# EAGLE design yuniminMainboard (EAGLE 4.11)
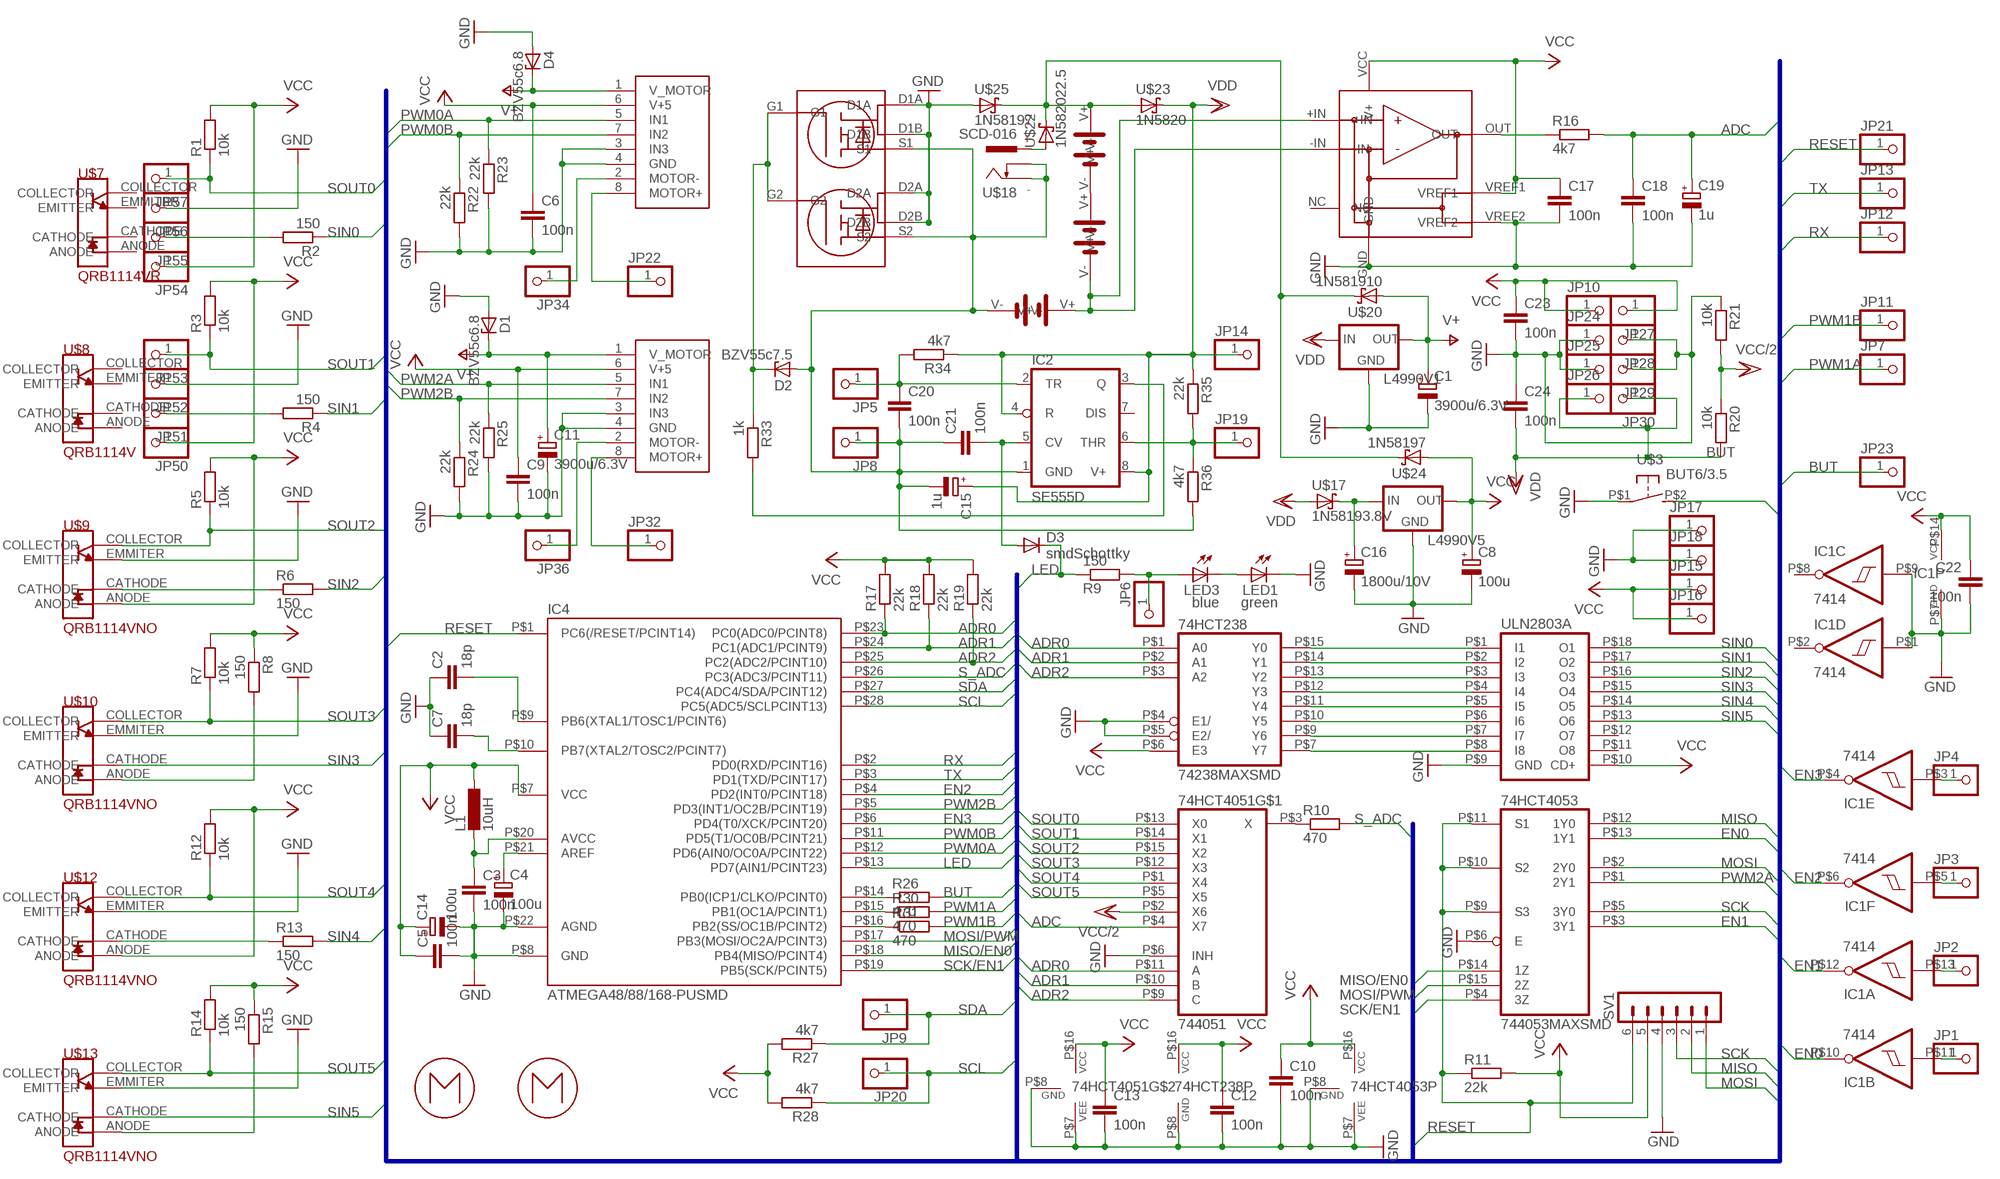
[diagram p0: schematic, sheet 1]

## Parts
74HCT238  74238MAXSMD  [DIL16SMD]
74HCT4051  744051  [DIL16SMD]
74HCT4053  744053MAXSMD  [DIL16SMD]
C1  3900u/6.3V  CPOL-EUE5-10.5  [E5-10,5]
C2  18p  C-EUC1206  [C1206]
C3  100n  C-EUC1206  [C1206]
C4  100u  CPOL-EUC/6032-28R  [C/6032-28R]
C5  100n  C-EUC1206  [C1206]
C6  100n  C-EUC1206  [C1206]
C7  18p  C-EUC1206  [C1206]
C8  100u  CPOL-EUC/6032-28R  [C/6032-28R]
C9  100n  C-EUC1206  [C1206]
C10  100n  C-EUC1206  [C1206]
C11  3900u/6.3V  CPOL-EUE5-10.5  [E5-10,5]
C12  100n  C-EUC1206  [C1206]
C13  100n  C-EUC1206  [C1206]
C14  100u  CPOL-EUC/6032-28R  [C/6032-28R]
C15  1u  CPOL-EUB/3528-21R  [B/3528-21R]
C16  1800u/10V  CPOL-EUE5-10.5  [E5-10,5]
C17  100n  C-EUC1206  [C1206]
C18  100n  C-EUC1206  [C1206]
C19  1u  CPOL-EUB/3528-21R  [B/3528-21R]
C20  100n  C-EUC1206  [C1206]
C21  100n  C-EUC1206  [C1206]
C22  100n  C-EUC1206  [C1206]
C23  100n  C-EUC1206  [C1206]
C24  100n  C-EUC1206  [C1206]
D1  BZV55c6.8  ZENER-DIODESOD80C  [SOD80C]
D2  BZV55c7.5  ZENER-DIODESOD80C  [SOD80C]
D3  smdSchottky  DIODE-DO214BA  [DO-214BA]
D4  BZV55c6.8  ZENER-DIODESOD80C  [SOD80C]
IC1  7414  7414MAXISMD  [DIL14SMD]
IC2  SE555D  [SO08]
IC4  ATMEGA48/88/168-PUSMD  [DIL28-SMD]
JP1  PINHD-1X1  [1X01]
JP2  PINHD-1X1  [1X01]
JP3  PINHD-1X1  [1X01]
JP4  PINHD-1X1  [1X01]
JP5  PINHD-1X1  [1X01]
JP6  PINHD-1X1  [1X01]
JP7  PINHD-1X1  [1X01]
JP8  PINHD-1X1  [1X01]
JP9  PINHD-1X1  [1X01]
JP10  PINHD-1X1  [1X01]
JP11  PINHD-1X1  [1X01]
JP12  PINHD-1X1  [1X01]
JP13  PINHD-1X1  [1X01]
JP14  PINHD-1X1  [1X01]
JP15  PINHD-1X1  [1X01]
JP16  PINHD-1X1  [1X01]
JP17  PINHD-1X1  [1X01]
JP18  PINHD-1X1  [1X01]
JP19  PINHD-1X1  [1X01]
JP20  PINHD-1X1  [1X01]
JP21  PINHD-1X1  [1X01]
JP22  PINHD-1X1  [1X01]
JP23  PINHD-1X1  [1X01]
JP24  PINHD-1X1  [1X01]
JP25  PINHD-1X1  [1X01]
JP26  PINHD-1X1  [1X01]
JP27  PINHD-1X1  [1X01]
JP28  PINHD-1X1  [1X01]
JP29  PINHD-1X1  [1X01]
JP30  PINHD-1X1  [1X01]
JP32  PINHD-1X1  [1X01]
JP34  PINHD-1X1  [1X01]
JP36  PINHD-1X1  [1X01]
JP50  PINHD-1X1  [1X01]
JP51  PINHD-1X1  [1X01]
JP52  PINHD-1X1  [1X01]
JP53  PINHD-1X1  [1X01]
JP54  PINHD-1X1  [1X01]
JP55  PINHD-1X1  [1X01]
JP56  PINHD-1X1  [1X01]
JP57  PINHD-1X1  [1X01]
L1  10uH  L-EU0207/10  [0207/10]
L4990V1  78XXS  [78XXS]
L4990V5  78XXS  [78XXS]
LED1  green  LEDSMT1206  [1206]
LED3  blue  LED3MM  [LED3MM]
R1  10k  R-EU_R1206  [R1206]
R2  150  R-EU_R1206  [R1206]
R3  10k  R-EU_R1206  [R1206]
R4  150  R-EU_R1206  [R1206]
R5  10k  R-EU_R1206  [R1206]
R6  150  R-EU_R1206  [R1206]
R7  10k  R-EU_R1206  [R1206]
R8  150  R-EU_R1206  [R1206]
R9  150  R-EU_R1206  [R1206]
R10  470  R-EU_R1206  [R1206]
R11  22k  R-EU_R1206  [R1206]
R12  10k  R-EU_R1206  [R1206]
R13  150  R-EU_R1206  [R1206]
R14  10k  R-EU_R1206  [R1206]
R15  150  R-EU_R1206  [R1206]
R16  4k7  R-EU_R1206  [R1206]
R17  22k  R-EU_R1206  [R1206]
R18  22k  R-EU_R1206  [R1206]
R19  22k  R-EU_R1206  [R1206]
R20  10k  R-EU_R1206  [R1206]
R21  10k  R-EU_R1206  [R1206]
R22  22k  R-EU_R1206  [R1206]
R23  22k  R-EU_R1206  [R1206]
R24  22k  R-EU_R1206  [R1206]
R25  22k  R-EU_R1206  [R1206]
R26  470  R-EU_R1206  [R1206]
R27  4k7  R-EU_R1206  [R1206]
R28  4k7  R-EU_R1206  [R1206]
R30  470  R-EU_R1206  [R1206]
R31  470  R-EU_R1206  [R1206]
R33  1k  R-EU_R1206  [R1206]
R34  4k7  R-EU_R1206  [R1206]
R35  22k  R-EU_R1206  [R1206]
R36  4k7  R-EU_R1206  [R1206]
SV1  MA06-1  [MA06-1]
U$1  MOTORGW8TOP  [GW8L_TOP]
U$2  MOTORGW8TOP  [GW8L_TOP]
U$3  BUT6/3.5  [BUT6/3.5SMD]
U$4  ACU2  [ACU2AAA]
U$5  ACU2  [ACU2AAA]
U$6  ACU2  [ACU2AAA]
U$7  QRB1114VR  [QRB1114VR]
U$8  QRB1114V  QRB1114VL  [QRB1114VL]
U$9  QRB1114VNO  [QRB1114V]
U$10  QRB1114VNO  [QRB1114V]
U$12  QRB1114VNO  [QRB1114V]
U$13  QRB1114VNO  [QRB1114V]
U$14  AD8205  [SOIC8]
U$15  HT6751B  [SO8]
U$16  HT6751B  [SO8]
U$17  1N58193.8V  [DO41-3.8]
U$18  SCD-016  [SCD-016]
U$19  CEM9926  [SO8]
U$20  1N581910  [DO41-10]
U$22  1N582022.5  [DO201-22.5]
U$23  1N5820  [DO201VERTIKAL]
U$24  1N58197  [DO41-7]
U$25  1N58197  [DO41-7]
ULN2803A  ULN2803AMAXISMD  [DIL18SMD]

## Nets
ADC: 74HCT4051.P$4(X7) C18.1 C19.+ R16.2
ADR0: 74HCT238.P$1(A0) 74HCT4051.P$11(A) IC4.P$23(PC0(ADC0/PCINT8)) R17.1
ADR1: 74HCT238.P$2(A1) 74HCT4051.P$10(B) IC4.P$24(PC1(ADC1/PCINT9)) R18.1
ADR2: 74HCT238.P$3(A2) 74HCT4051.P$9(C) IC4.P$25(PC2(ADC2/PCINT10)) R19.1
BUT: JP23.1 R26.2 U$3.P$2(S)
EN0: 74HCT4053.P$13(1Y1) IC1.P$10(B:O)
EN1: 74HCT4053.P$3(3Y1) IC1.P$12(A:O)
EN2: IC1.P$6(F:O) IC4.P$4(PD2(INT0/PCINT18))
EN3: IC1.P$4(E:O) IC4.P$6(PD4(T0/XCK/PCINT20))
GND: 74HCT238.P$4(E1/) 74HCT238.P$5(E2/) 74HCT238.P$8(GND) 74HCT4051.P$6(INH) 74HCT4051.P$7(VEE) 74HCT4051.P$8(GND) 74HCT4053.P$6(E) 74HCT4053.P$7(VEE) 74HCT4053.P$8(GND) C1.- C2.1 C3.2 C4.- C5.2 C6.2 C7.1 C8.- C9.2 C10.2 C11.- C12.2 C13.2 C14.- C16.- C17.2 C18.2 C19.- C22.2 C23.2 C24.1 D1.A D4.A IC1.P$1(D:I) IC1.P$7(P:GND) IC1.P$9(C:I) IC4.P$8(GND) IC4.P$22(AGND) JP17.1 JP18.1 JP24.1 JP25.1 JP28.1 JP29.1 JP52.1 JP56.1 L4990V1.GND L4990V5.GND LED1.C R21.1 R22.2 R23.2 R24.2 R25.2 SV1.4 U$3.P$1(P) U$9.EMMITER(EMITTER) U$10.EMMITER(EMITTER) U$12.EMMITER(EMITTER) U$13.EMMITER(EMITTER) U$14.GND U$14.VREF2 U$15.3(IN3) U$15.4(GND) U$16.3(IN3) U$16.4(GND) U$19.D1A U$19.D1B U$19.D2A U$19.D2B U$25.A ULN2803A.P$9(GND)
LED: D3.C IC4.P$13(PD7(AIN1/PCINT23)) R9.1
MISO: 74HCT4053.P$12(1Y0) SV1.2
MISO/EN0: 74HCT4053.P$14(1Z) IC4.P$18(PB4(MISO/PCINT4))
MOSI: 74HCT4053.P$2(2Y0) SV1.1
MOSI/PWM: 74HCT4053.P$15(2Z) IC4.P$17(PB3(MOSI/OC2A/PCINT3))
N$1: JP55.1 R2.2
N$2: D2.C R33.1 U$19.G1 U$19.G2
N$3: 74HCT4051.P$3(X) R10.1
N$4: R6.1 U$9.CATHODE
N$5: U$4.V+ U$20.C U$22.C U$23.A U$24.C U$25.C
N$6: R15.2 U$13.ANODE
N$7: JP51.1 R4.2
N$8: C21.2 D3.A IC2.5(CV)
N$9: R8.2 U$10.ANODE
N$10: IC1.P$5(F:I) JP3.1
N$11: U$5.V- U$6.V+ U$14.+IN U$14.-IN
N$12: U$4.V- U$5.V+
N$13: 74HCT238.P$15(Y0) ULN2803A.P$1(I1)
N$14: 74HCT238.P$14(Y1) ULN2803A.P$2(I2)
N$15: 74HCT238.P$13(Y2) ULN2803A.P$3(I3)
N$16: 74HCT238.P$12(Y3) ULN2803A.P$4(I4)
N$17: 74HCT238.P$11(Y4) ULN2803A.P$5(I5)
N$18: 74HCT238.P$10(Y5) ULN2803A.P$6(I6)
N$19: 74HCT238.P$9(Y6) ULN2803A.P$7(I7)
N$20: 74HCT238.P$7(Y7) ULN2803A.P$8(I8)
N$21: JP6.1 LED3.A R9.2
N$22: IC4.P$14(PB0(ICP1/CLKO/PCINT0)) R26.1
N$23: C3.1 IC4.P$20(AVCC) L1.2
N$24: C4.+ IC4.P$21(AREF)
N$25: JP32.1 U$15.8(MOTOR+)
N$26: JP36.1 U$15.2(MOTOR-)
N$27: JP22.1 U$16.8(MOTOR+)
N$28: JP34.1 U$16.2(MOTOR-)
N$29: LED1.A LED3.K(C)
N$30: R13.1 U$12.CATHODE
N$32: IC4.P$15(PB1(OC1A/PCINT1)) R30.1
N$33: IC4.P$16(PB2(SS/OC1B/PCINT2)) R31.1
N$34: C7.2 IC4.P$10(PB7(XTAL2/TOSC2/PCINT7))
N$35: C2.2 IC4.P$9(PB6(XTAL1/TOSC1/PCINT6))
N$36: IC1.P$13(A:I) JP2.1
N$37: C16.+ L4990V5.IN U$17.C
N$38: U$18.+ U$22.A
N$39: IC1.P$3(E:I) JP4.1
N$40: IC1.P$11(B:I) JP1.1
N$42: R16.1 U$14.OUT
N$44: IC2.3(Q) R33.2
PWM0A: IC4.P$12(PD6(AIN0/OC0A/PCINT22)) R23.1 U$16.5(IN1)
PWM0B: IC4.P$11(PD5(T1/OC0B/PCINT21)) R22.1 U$16.7(IN2)
PWM1A: JP7.1 R30.2
PWM1B: JP11.1 R31.2
PWM2A: 74HCT4053.P$1(2Y1) R25.1 U$15.5(IN1)
PWM2B: IC4.P$5(PD3(INT1/OC2B/PCINT19)) R24.1 U$15.7(IN2)
RESET: 74HCT4053.P$9(S3) 74HCT4053.P$10(S2) 74HCT4053.P$11(S1) IC4.P$1(PC6(/RESET/PCINT14)) JP21.1 R11.1 SV1.6
RX: IC4.P$2(PD0(RXD/PCINT16)) JP12.1
S_ADC: IC4.P$26(PC3(ADC3/PCINT11)) R10.2
SCK: 74HCT4053.P$5(3Y0) SV1.3
SCK/EN1: 74HCT4053.P$4(3Z) IC4.P$19(PB5(SCK/PCINT5))
SCL: IC4.P$28(PC5(ADC5/SCLPCINT13)) JP20.1 R28.1
SDA: IC4.P$27(PC4(ADC4/SDA/PCINT12)) JP9.1 R27.1
SIN0: R2.1 ULN2803A.P$18(O1)
SIN1: R4.1 ULN2803A.P$17(O2)
SIN2: R6.2 ULN2803A.P$16(O3)
SIN3: U$10.CATHODE ULN2803A.P$15(O4)
SIN4: R13.2 ULN2803A.P$14(O5)
SIN5: U$13.CATHODE ULN2803A.P$13(O6)
SOUT0: 74HCT4051.P$13(X0) JP57.1 R1.1
SOUT1: 74HCT4051.P$14(X1) JP53.1 R3.1
SOUT2: 74HCT4051.P$15(X2) R5.1 U$9.COLLECTOR
SOUT3: 74HCT4051.P$12(X3) R7.1 U$10.COLLECTOR
SOUT4: 74HCT4051.P$1(X4) R12.1 U$12.COLLECTOR
SOUT5: 74HCT4051.P$5(X5) R14.1 U$13.COLLECTOR
THR: IC2.6(THR) JP19.1 R35.2 R36.1
TR: C20.1 IC2.2(TR) JP5.1 R34.2
TX: IC4.P$3(PD1(TXD/PCINT17)) JP13.1
V+: C1.+ C11.+ D1.C D4.C L4990V1.OUT U$15.1(V_MOTOR) U$16.1(V_MOTOR) U$20.A
V-BAT: C15.- C20.2 C21.1 D2.A IC2.1(GND) JP8.1 R36.2 U$6.V- U$18.- U$18.C U$19.S1 U$19.S2
VCC: 74HCT238.P$6(E3) 74HCT238.P$16(VCC) 74HCT4051.P$16(VCC) 74HCT4053.P$16(VCC) C5.1 C6.1 C8.+ C9.1 C10.1 C12.1 C13.1 C14.+ C17.1 C22.1 C23.1 IC1.P$14(P:VCC) IC4.P$7(VCC) JP10.1 JP15.1 JP16.1 JP27.1 JP50.1 JP54.1 L1.1 L4990V5.OUT R1.2 R3.2 R5.2 R7.2 R8.1 R11.2 R12.2 R14.2 R15.1 R17.2 R18.2 R19.2 R27.2 R28.2 SV1.5 U$9.ANODE U$12.ANODE U$14.VCC(V+) U$14.VREF1 U$15.6(V+5) U$16.6(V+5) U$24.A ULN2803A.P$10(CD+)
VCC/2: 74HCT4051.P$2(X6) R20.1 R21.2
VDD: C15.+ C24.2 IC2.4(R) IC2.8(V+) JP14.1 JP26.1 JP30.1 L4990V1.IN R20.2 R34.1 R35.1 U$17.A U$23.C
Unconnected: IC1.P$2(D:O) IC1.P$8(C:O) IC2.7(DIS) U$7.ANODE U$7.CATHODE U$7.COLLECTOR U$7.EMMITER(EMITTER) U$8.ANODE U$8.CATHODE U$8.COLLECTOR U$8.EMMITER(EMITTER) U$14.NC ULN2803A.P$11(O8) ULN2803A.P$12(O7)

## Buses
ADC,S_ADC,ADR[0..2],LED,EN[0..3],PWM0A,BUT,PWM1A,PWM1B,PWM0B,SCK,SCK/EN1,MISO,MISO/EN0,MOSI,MOSI/PWM,PWM2A,PWM2B,RESET,SDA,SCL,SIN[0..7],SOUT[0..7],RX,TX

## Library data of the parts
74HCT238 = 74:74*238: 3-line to 8-line DECODER/DEMULTIPLEXER
74HCT4051 = 74:74*4051
74HCT4053 = 74:74*4053: Triple 2-channel analog multiplexer/demultiplexer Philips Semiconductor
C1 C4 C8 C11 C14-C16 C19 = rcl:CPOL-EU: POLARIZED CAPACITOR, European symbol
C2 C3 C5-C7 C9 C10 C12 C13 C17 C18 C20-C24 = rcl:C-EU: CAPACITOR, European symbol
D1 D2 D4 = diode:ZENER-DIODE: Z-Diode
D3 = diode:DIODE-: DIODE
IC1 = 74:74*14: Hex schmitt trigger INVERTER
IC2 = linear:*555: TIMER
IC4 = atmega8:ATMEGA48/88/168-PU
JP1-JP30 JP32 JP34 JP36 JP50-JP57 = pinhead:PINHD-1X1: PIN HEADER
L1 = rcl:L-EU: INDUCTOR, European symbol
L4990V1 L4990V5 = v-reg:78XXS: VOLTAGE REGULATOR
LED1 LED3 = led:LED: LED OSRAM: - CHIPLED LG R971, LG N971, LY N971, LG Q971, LY Q971, LO R971, LY R971 LH N974, LH R974 LS Q976, LO Q976, LY Q976 LO Q996 - Hyper CHIPLED LW Q18S LB Q993, LB Q99A, LB R99A - SideLED LS A670, LO A670, LY A670, LG A670, LP A670 LB A673, LV A673, LT A673, LW A673 LH A674 LY A675 LS A676, LA A676, LO A676, LY A676, LW A676 LS A679, LY A679, LG A679 - Hyper Micro SIDELED® LS Y876, LA Y876, LO Y876, LY Y876 LT Y87S - SmartLED LW L88C, LW L88S LB L89C, LB L89S, LG L890 LS L89K, LO L89K, LY L89K LS L896, LA L896, LO L896, LY L896 - TOPLED LS T670, LO T670, LY T670, LG T670, LP T670 LSG T670, LSP T670, LSY T670, LOP T670, LYG T670 LG T671, LOG T671, LSG T671 LB T673, LV T673, LT T673, LW T673 LH T674 LS T676, LA T676, LO T676, LY T676, LB T676, LH T676, LSB T676, LW T676 LB T67C, LV T67C, LT T67C, LS T67K, LO T67K, LY T67K, LW E67C LS E67B, LA E67B, LO E67B, LY E67B, LB E67C, LV E67C, LT E67C LW T67C LS T679, LY T679, LG T679 LS T770, LO T770, LY T770, LG T770, LP T770 LB T773, LV T773, LT T773, LW T773 LH T774 LS E675, LA E675, LY E675, LS T675 LS T776, LA T776, LO T776, LY T776, LB T776 LHGB T686 LT T68C, LB T68C - Hyper Mini TOPLED® LB M676 - Mini TOPLED Santana® LG M470 LS M47K, LO M47K, LY M47K Source: http://www.osram.convergy.de/
R1-R28 R30 R31 R33-R36 = rcl:R-EU_: RESISTOR, European symbol
SV1 = con-lstb:MA06-1: PIN HEADER
U$1 U$2 = motors:MOTORGW8
U$3 = but:BUT6/3.5
U$4-U$6 = acu:ACU2
U$7-U$10 U$12 U$13 = sensor:QRB1114V
U$14 = oa:AD8205
U$15 U$16 = drivers:HT6751B
U$17 U$20 U$24 U$25 = diode:1N5819
U$18 = conectors:SCD-016
U$19 = unipolartransistor:CEM9926
U$22 U$23 = diode:1N5820
ULN2803A = uln:ULN2803A: DRIVER ARRAY

## Board
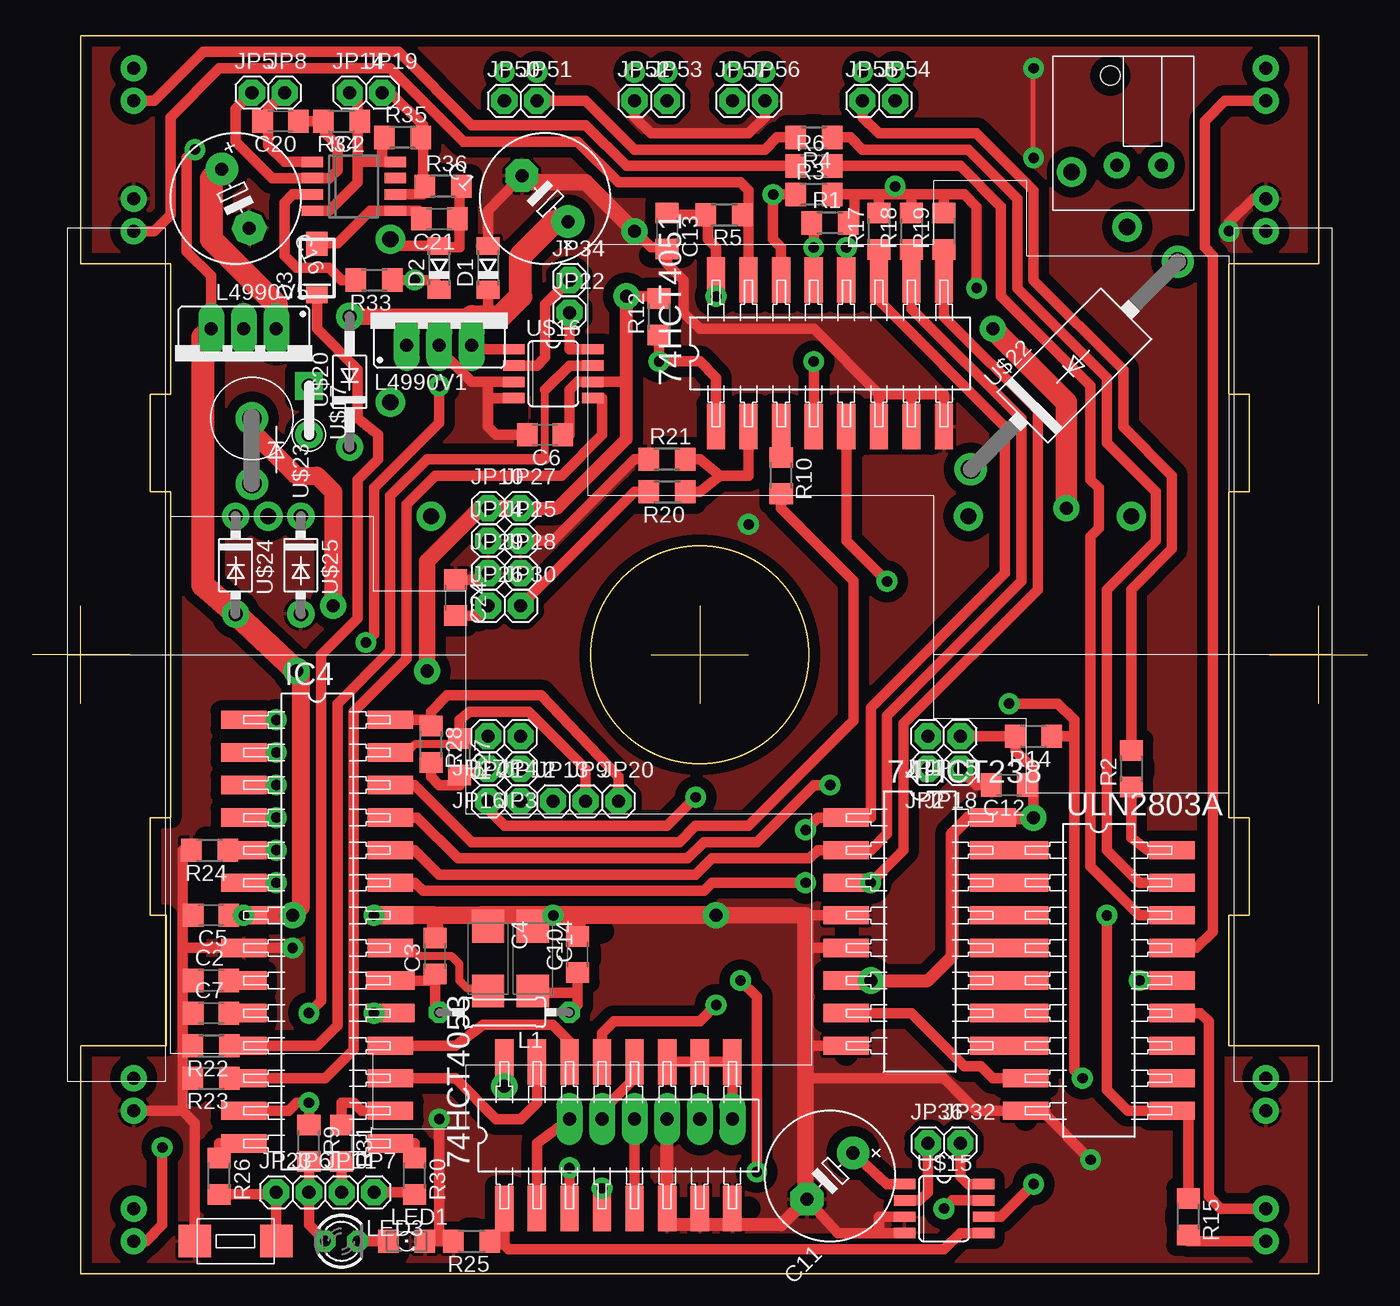
[diagram p1: board, top side]
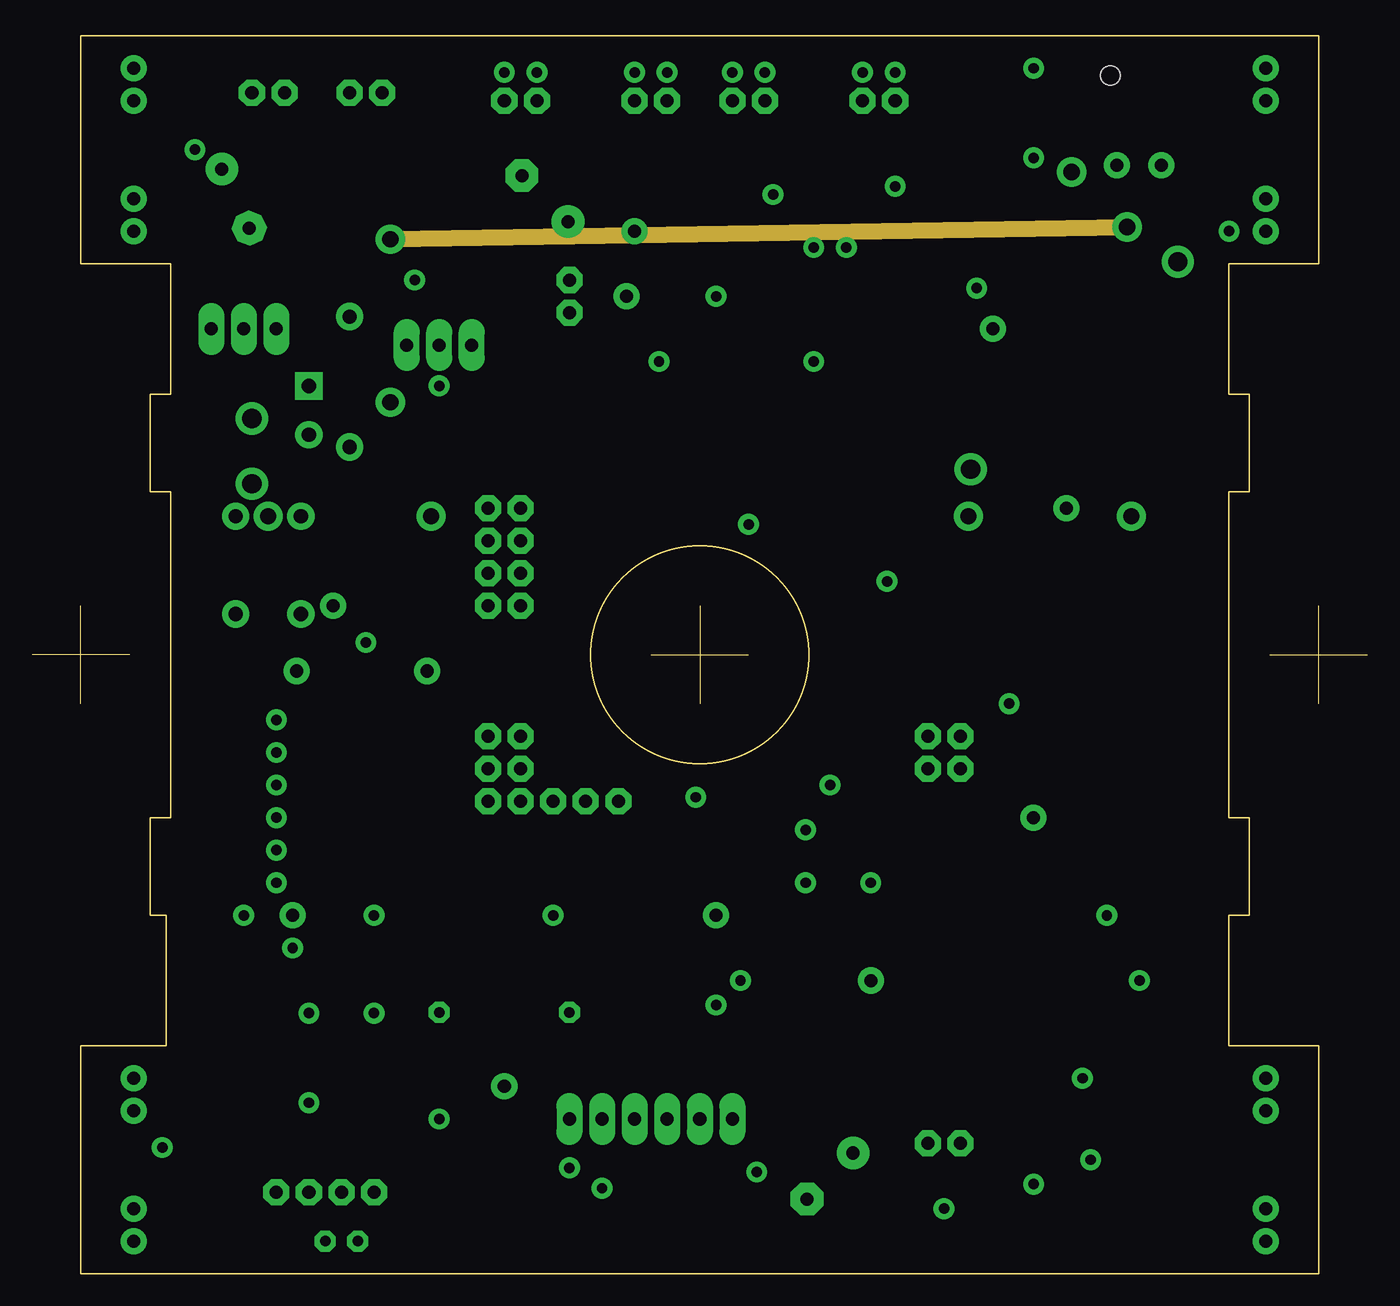
[diagram p2: board, inner layer Route9]
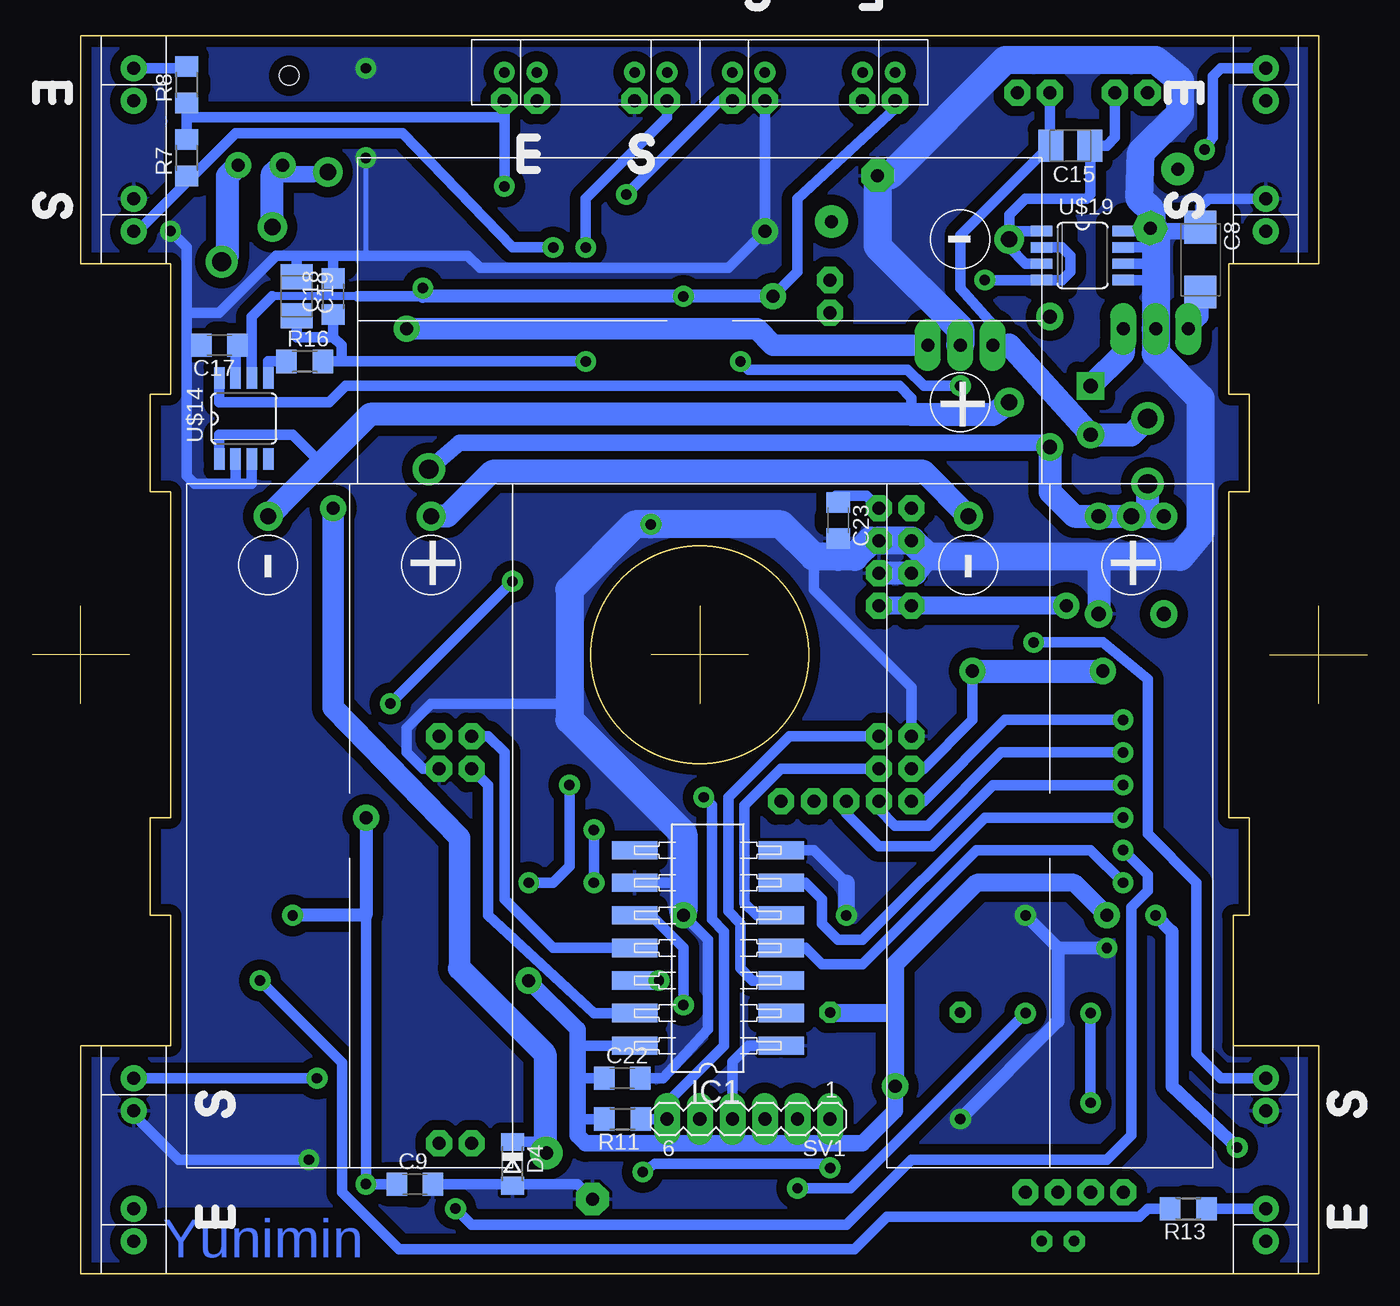
[diagram p3: board, bottom side, seen from below]

Size 104.14 x 96.52 mm. Coordinates in mm from the lower left corner, seen from the top.
Outline: 48.26,48.26 55.88,48.26
Outline: 52.07,52.07 52.07,44.45
Outline: 96.52,48.26 104.14,48.26
Outline: 100.33,44.45 100.33,52.07
Outline: 7.62,48.26 0,48.26
Outline: 3.81,44.45 3.81,52.07
Outline: 3.81,0 100.33,0 100.33,17.78 93.34,17.78 93.34,27.94 94.93,27.94 94.93,35.56 93.34,35.56 93.34,60.96 94.93,60.96 94.93,68.58 93.34,68.58 93.34,78.74 100.33,78.74 100.33,96.52 3.81,96.52 3.81,78.74 10.8,78.74 10.8,68.58 9.21,68.58 9.21,60.96 10.8,60.96 10.8,35.56 9.21,35.56 9.21,27.94 10.48,27.94 10.48,17.78 3.81,17.78 3.81,0
Outline: circle at 52.07,48.26 radius 8.5
Copper layers (1*16): Top 0.035mm / dielectric 1.5mm / Bottom 0.035mm
Design rules "default": minimum track width 10mil, minimum drill 24mil, track to track 8mil, track to pad 8mil, pad to pad 8mil, via to via 8mil, smd to smd 8mil, copper to edge 1mil, drill to drill 1mil, minimum pad ring 10mil, minimum via ring 8mil, stop-mask expansion 4mil, vias tented up to drill 0mil, thermal gap 10mil
tRestrict: 18 lines
bRestrict: 10 lines

### Footprints (pad centres in the part's own frame; a part is rotated, then mirrored left to right if it is on the bottom)
DIL16SMD = smd 1.422 x 3.556: P$1 -8.89,-6.35; P$2 -6.35,-6.35; P$3 -3.81,-6.35; P$4 -1.27,-6.35; P$5 1.27,-6.35; P$6 3.81,-6.35; P$7 6.35,-6.35; P$8 8.89,-6.35; P$9 8.89,5.08; P$10 6.35,5.08; P$11 3.81,5.08; P$12 1.27,5.08; P$13 -1.27,5.08; P$14 -3.81,5.08; P$15 -6.35,5.08; P$16 -8.89,5.08
E5-10,5 = drill 1.016 pad 2.54 round: + -2.54,0 | drill 1.016 pad 2.54 octagon: - 2.54,0
C1206 = smd 1.6 x 1.8: 1 -1.4,0; 2 1.4,0
C/6032-28R = smd 2.55 x 2.5: + 2.525,0; - -2.525,0
B/3528-21R = smd 1.95 x 2.5: + 1.525,0; - -1.525,0
SOD80C = smd 1.4 x 1.8: A 1.7,0; C -1.7,0
DO-214BA = smd 1.85 x 1.68: A 1.87,0 | smd 1.32 x 1.68: C -2.12,0
DIL14SMD = smd 1.422 x 3.556: P$1 -8.89,-6.35; P$2 -6.35,-6.35; P$3 -3.81,-6.35; P$4 -1.27,-6.35; P$5 1.27,-6.35; P$6 3.81,-6.35; P$7 6.35,-6.35; P$8 6.35,5.08; P$9 3.81,5.08; P$10 1.27,5.08; P$11 -1.27,5.08; P$12 -3.81,5.08; P$13 -6.35,5.08; P$14 -8.89,5.08
SO08 = smd 0.813 x 1.676: 1 -1.905,-3.235; 2 -0.635,-3.235; 3 0.635,-3.235; 4 1.905,-3.235; 5 1.905,3.235; 6 0.635,3.235; 7 -0.635,3.235; 8 -1.905,3.235
DIL28-SMD = smd 1.422 x 3.556: P$1 -16.51,-6.35; P$2 -13.97,-6.35; P$3 -11.43,-6.35; P$4 -8.89,-6.35; P$5 -6.35,-6.35; P$6 -3.81,-6.35; P$7 -1.27,-6.35; P$8 1.27,-6.35; P$9 3.81,-6.35; P$10 6.35,-6.35; P$11 8.89,-6.35; P$12 11.43,-6.35; P$13 13.97,-6.35; P$14 16.51,-6.35; P$15 16.51,5.08; P$16 13.97,5.08; P$17 11.43,5.08; P$18 8.89,5.08; P$21 1.27,5.08; P$22 -1.27,5.08; P$23 -3.81,5.08; P$24 -6.35,5.08; P$25 -8.89,5.08; P$26 -11.43,5.08; P$27 -13.97,5.08; P$28 -16.51,5.08 | smd 1.422 x 3.81: P$19 6.35,5.08; P$20 3.81,5.08
1X01 = drill 1.016 octagon: 1 0,0
0207/10 = drill 0.813 octagon: 1 -5.08,0; 2 5.08,0
78XXS = drill 1.016 long: GND 0,-2.54; IN -2.54,-2.54; OUT 2.54,-2.54
1206 = smd 1.6 x 1.803: A -1.422,0; C 1.422,0
LED3MM = drill 0.813 octagon: A -1.27,0; K 1.27,0
R1206 = smd 1.6 x 1.803: 1 -1.422,0; 2 1.422,0
MA06-1 = drill 1.016 long: 1 -6.35,0; 2 -3.81,0; 3 -1.27,0; 4 1.27,0; 5 3.81,0; 6 6.35,0
BUT6/3.5SMD = smd 2.54 x 2.54: P$1 -2.54,0; P$2 3.81,0
ACU2AAA = drill 1.27 pad 1.778 round: V+ 24.13,-6.35; V- 24.13,6.35
QRB1114VR = drill 0.813 round: ANODE -2.54,6.35; CATHODE -2.54,3.81; COLLECTOR -2.54,-6.35; EMMITER -2.54,-3.81
QRB1114VL = drill 0.813 round: ANODE -2.54,6.35; CATHODE -2.54,3.81; COLLECTOR -2.54,-6.35; EMMITER -2.54,-3.81
QRB1114V = drill 1.016 round: ANODE -2.54,6.35; CATHODE -2.54,3.81; COLLECTOR -2.54,-6.35; EMMITER -2.54,-3.81
SOIC8 = smd 0.813 x 1.676: +IN -1.905,3.175; -IN -1.905,-3.175; GND -0.635,-3.175; NC 1.905,-3.175; OUT 1.905,3.175; VCC 0.635,3.175; VREF1 -0.635,3.175; VREF2 0.635,-3.175
SO8 = smd 0.813 x 1.676: 1 -1.905,-3.073; 2 -0.635,-3.073; 3 0.635,-3.073; 4 1.905,-3.073; 5 1.905,3.073; 6 0.635,3.073; 7 -0.635,3.073; 8 -1.905,3.073
DO41-3.8 = drill 1.118 round: A 1.905,0 | drill 1.118 square: C -1.905,0
SCD-016 = drill 1.016 round: + 2.475,2.975; C 2.475,-0.5 | drill 1.27 round: - 3.01,-4.01 | hole 1.5: -4.5,-1
SO8' = smd 0.813 x 1.676: D1A -1.905,3.175; D1B -0.635,3.175; D2A 0.635,3.175; D2B 1.905,3.175; G1 -0.635,-3.175; G2 1.905,-3.175; S1 -1.905,-3.175; S2 0.635,-3.175
DO41-10 = drill 1.118 round: A 5.08,0; C -5.08,0
DO201-22.5 = drill 1.499 round: A 11.43,0; C -11.43,0
DO201VERTIKAL = drill 1.499 round: A 5.08,0; C 0,0
DO41-7 = drill 1.118 round: A 3.81,0; C -3.81,0
DIL18SMD = smd 1.422 x 3.556: P$1 -10.16,-6.35; P$2 -7.62,-6.35; P$3 -5.08,-6.35; P$4 -2.54,-6.35; P$5 0,-6.35; P$6 2.54,-6.35; P$7 5.08,-6.35; P$8 7.62,-6.35; P$9 10.16,-6.35; P$10 10.16,5.08; P$11 7.62,5.08; P$12 5.08,5.08; P$13 2.54,5.08; P$14 0,5.08; P$15 -2.54,5.08; P$16 -5.08,5.08; P$17 -7.62,5.08; P$18 -10.16,5.08

### Placement (x,y rotation side)
74HCT238  69.85,26.67 270 top
74HCT4051  62.23,72.39 0 top
74HCT4053  45.72,11.43 0 top
C1  40.01,83.82 135 top
C2  13.97,22.86 0 top
C3  31.43,24.76 90 top
C4  35.56,24.57 270 top
C5  13.97,27.94 180 top
C6  40.01,65.41 180 top
C7  13.97,20.32 0 top
C8  13.02,79.06 270 bottom
C9  74.3,6.98 0 bottom
C10  42.55,24.89 90 top
C11  62.23,7.62 225 top
C12  76.2,38.1 180 top
C13  49.53,81.28 270 top
C14  39.05,24.57 270 top
C15  23.18,87.95 180 bottom
C16  15.88,83.82 295 top
C17  89.53,72.39 180 bottom
C18  80.64,76.2 90 bottom
C19  83.5,76.2 270 bottom
C20  19.37,89.85 180 top
C21  31.75,82.23 180 top
C22  58.1,15.24 0 bottom
C23  41.27,58.74 270 bottom
C24  33.02,52.7 270 top
D1  35.56,78.42 90 top
D2  31.75,78.42 90 top
D3  22.23,78.42 90 top
D4  66.67,8.57 270 bottom
IC1  52.07,26.67 90 bottom
IC2  25.08,84.77 270 top
IC4  22.86,26.67 270 top
JP1  69.85,41.91 180 top
JP2  69.85,39.37 180 top
JP3  38.1,39.37 180 top
JP4  38.1,41.91 180 top
JP5  17.15,92.07 0 top
JP6  21.59,6.35 0 top
JP7  26.67,6.35 0 top
JP8  19.69,92.07 0 top
JP9  43.18,36.83 0 top
JP10  35.56,59.69 0 top
JP11  24.13,6.35 0 top
JP12  38.1,36.83 0 top
JP13  40.64,36.83 0 top
JP14  24.77,92.07 0 top
JP15  72.39,41.91 180 top
JP16  35.56,39.37 180 top
JP17  35.56,41.91 180 top
JP18  72.39,39.37 180 top
JP19  27.3,92.07 0 top
JP20  45.72,36.83 0 top
JP21  35.56,36.83 0 top
JP22  41.91,74.93 0 top
JP23  19.05,6.35 0 top
JP24  35.56,57.15 0 top
JP25  38.1,57.15 0 top
JP26  35.56,52.07 0 top
JP27  38.1,59.69 0 top
JP28  38.1,54.61 0 top
JP29  35.56,54.61 0 top
JP30  38.1,52.07 0 top
JP32  72.39,10.16 0 top
JP34  41.91,77.47 0 top
JP36  69.85,10.16 0 top
JP50  36.83,91.44 0 top
JP51  39.37,91.44 0 top
JP52  46.99,91.44 0 top
JP53  49.53,91.44 0 top
JP54  67.31,91.44 0 top
JP55  64.77,91.44 0 top
JP56  57.15,91.44 0 top
JP57  54.61,91.44 0 top
L1  36.83,20.38 180 top
L4990V1  31.75,74.93 0 top
L4990V5  16.51,71.12 180 top
LED1  29.21,2.54 0 top
LED3  24.13,2.54 0 top
R1  62.23,81.91 0 top
R2  85.72,39.37 90 top
R3  60.96,84.14 0 top
R4  60.96,88.58 180 top
R5  53.98,82.55 180 top
R6  60.96,86.36 0 top
R7  92.08,87 90 bottom
R8  92.08,92.71 90 bottom
R9  21.59,10.16 270 top
R10  58.42,62.23 270 top
R11  58.1,12.06 180 bottom
R12  48.9,74.61 90 top
R13  13.97,5.08 180 bottom
R14  78.11,41.91 180 top
R15  90.17,4.45 270 top
R16  82.87,71.12 0 bottom
R17  66.04,81.28 90 top
R18  68.58,81.28 90 top
R19  71.12,81.28 90 top
R20  49.53,60.96 180 top
R21  49.53,63.5 0 top
R22  13.97,17.78 180 top
R23  13.97,15.24 180 top
R24  13.84,33.02 180 top
R25  34.29,2.54 180 top
R26  14.6,7.62 270 top
R27  33.34,40.32 270 top
R28  31.12,41.27 270 top
R30  29.84,7.62 270 top
R31  24.13,10.16 270 top
R33  26.67,77.47 180 top
R34  24.13,89.85 180 top
R35  28.89,88.58 0 top
R36  32.07,84.77 0 top
SV1  48.26,12.06 180 bottom
U$1  93.34,48.26 90 top
U$2  10.8,48.26 270 top
U$3  15.24,2.54 0 top
U$4  24.77,34.92 90 bottom
U$5  79.38,34.92 90 bottom
U$6  52.07,74.3 0 bottom
U$7  60.96,96.2 90 bottom
U$8  43.18,91.12 270 bottom
U$9  5.4,87.63 0 bottom
U$10  93.66,87.63 0 bottom
U$12  10.48,8.89 180 bottom
U$13  98.74,8.89 180 bottom
U$14  87.63,66.67 0 bottom
U$15  71.12,5.08 270 top
U$16  40.64,70.17 270 top
U$17  21.59,67.31 270 top
U$18  85.09,88.9 270 top
U$19  CEM9926  [SO8']  22.23,79.38 270 bottom
U$20  24.77,69.53 90 top
U$22  81.28,70.8 45 top
U$23  17.15,66.67 270 top
U$24  15.88,55.24 270 top
U$25  20.96,55.24 270 top
ULN2803A  83.82,22.86 270 top

### Tracks (layer width: path | path; a pad name or v marks a point on that pad's centre or on a via)
ADC  (via drill 0.81)
  Top 0.813: 74HCT4051.P$4 v60.96,71.12
  Bottom 0.813: v60.96,71.12 80.01,71.12 | 80.01,71.12 R16.2 | 80.01,71.12 80.01,72.39 80.64,73.03 | 80.64,73.03 C18.1 | C19.+ 83.5,73.03 80.64,73.03
ADR0  (via drill 0.81)
  Top 0.813: R17.1 74HCT4051.P$11 66.04,75.88 75.88,66.04 75.88,54.61 65.41,44.13 65.41,35.56 74HCT238.P$1 61.28,35.56 v60.33,34.61 | v60.33,30.48 53.02,30.48 52.39,29.84 30.48,29.84 29.84,30.48 IC4.P$23
  Bottom 0.813: v60.33,34.61 v60.33,30.48
ADR1
  Top 0.813: R18.1 74HCT4051.P$10 68.58,75.25 77.15,66.67 77.15,53.97 66.67,43.5 66.67,34.29 65.41,33.02 74HCT238.P$2 61.28,33.02 60.64,32.38 53.02,32.38 51.75,31.11 31.75,31.11 29.84,33.02 IC4.P$24
ADR2  (via drill 0.81)
  Top 0.61: v65.41,30.48 74HCT238.P$3
  Top 0.813: IC4.P$25 30.04,35.56 33.21,32.38 51.12,32.38 52.39,33.66 56.52,33.66 60.96,38.1 v62.23,38.1 | R19.1 74HCT4051.P$9 71.12,74.61 78.42,67.31 78.42,53.34 67.94,42.86 67.94,33.02 v65.41,30.48
  Bottom 0.813: v62.23,38.1 62.23,31.75 74HCT238.P$3 v65.41,30.48
BUT
  Top 0.813: R26.2 18.9,6.2 JP23.1 U$3.P$2
EN0  (via drill 0.81)
  Top 0.813: 74HCT4053.P$13 44.45,18.73 45.4,19.68 52.07,19.68 v53.34,20.95
  Bottom 0.813: v53.34,20.95 53.34,25.4 55.88,27.94 IC1.P$10
EN1  (via drill 0.81)
  Top 0.813: v41.91,8.25 74HCT4053.P$3 | v56.52,7.94 56.52,21.59 v55.24,22.86
  Bottom 0.813: v56.52,7.94 55.56,8.57 42.55,8.57 v41.91,8.25 | IC1.P$12 v55.24,22.86
EN2  (via drill 0.81)
  Top 0.813: v19.05,35.56 IC4.P$4
  Bottom 0.813: v19.05,35.56 29.84,35.56 39.37,26.03 41.27,26.03 42.55,27.3 42.55,29.21 43.81,30.48 IC1.P$6
EN3  (via drill 0.81)
  Top 0.813: v19.05,30.48 IC4.P$6
  Bottom 0.813: v19.05,30.48 21.59,33.02 30.48,33.02 39.37,24.13 42.55,24.13 43.81,25.4 IC1.P$4
GND  (via drill 0.81, 1.02, 1.02 pad 1.02)
  Top 0.406: v78.11,87 v78.11,93.98
  Top 0.61: 38.73,65.41 C6.2
  Top 0.813: 54.61,4.45 74HCT4053.P$8 54.61,3.81 | 60.33,25.4 74HCT238.P$5 | C12.2 73.66,38.1 JP18.1 | 60.33,17.78 74HCT238.P$8 | L4990V1.GND 31.75,72.07 34.29,69.53 35.56,69.53 | 78.74,12.7 v82.55,8.89 | 11.75,15.24 11.75,12.7 | 35.56,69.53 U$16.3 | 35.56,69.53 35.56,68.26 | 35.56,68.26 U$16.4 | R21.1 46.99,63.5 40.64,57.15 JP25.1 | 11.75,15.24 R23.2 | 11.75,17.78 11.75,15.24 | 11.75,17.78 R22.2 | 11.75,20.32 11.75,17.78 | 11.75,20.32 C7.1 | 11.75,22.86 11.75,20.32 | 11.75,22.86 C2.1 | 11.75,25.4 11.75,27.94 | 11.75,25.4 11.75,22.86 | 11.75,27.94 C5.2 | R24.2 11.75,33.02 11.75,27.94 | 11.75,25.4 IC4.P$8 v20.32,25.4 | ULN2803A.P$9 73.66,12.7 71.12,15.24 60.33,15.24 | 31.75,2.54 R25.2 | v31.75,12.06 31.75,2.54 | 35.56,68.26 35.56,66.04 36.2,65.41 38.73,65.41 | 31.75,2.54 LED1.C | 60.33,27.94 74HCT238.P$4 | 52.07,3.81 74HCT4053.P$7 | 49.53,3.81 74HCT4053.P$6 | U$3.P$1 12.7,11.75 11.75,12.7 | C11.- 62.87,3.17 66.04,3.17 | 66.04,3.17 U$15.4 | U$15.3 66.04,4.45 66.04,3.17 | C24.1 35.05,54.1 JP29.1 | D1.A 35.56,82.87 37.74,85.13 | C1.- 37.74,85.13 | v46.99,81.28 48.26,80.01 49.53,80.01 C13.2 49.53,78.74 50.8,77.47 50.8,74.93 52.07,73.66 60.96,73.66 66.04,68.58 | 37.78,85.09 37.74,85.13 | JP56.1 57.15,90.17 55.88,88.9 48.26,88.9 46.99,90.17 JP52.1 | 74HCT4051.P$8 71.12,68.58 68.58,68.58 | 66.04,68.58 68.58,68.58 | 68.58,68.58 74HCT4051.P$7 | 66.04,68.58 74HCT4051.P$6 | 11.75,12.7 U$12.EMMITER | U$10.EMMITER 95.25,83.82 93.34,81.91 v93.34,81.28
  Top 1.016: 74HCT4053.P$6 SV1.4 | 49.53,3.81 52.07,3.81 54.61,3.81 58.42,3.81 C11.-
  Top 1.27: 31.43,27.94 C3.2 | 42.55,27.94 C10.2 | v53.34,27.94 60.33,27.94 60.33,25.4 60.33,17.78 60.33,15.24 60.33,6.03 60.43,5.92 C11.- | v46.99,81.28 43.18,85.09 37.78,85.09
  Top 1.422: v53.34,27.94 42.55,27.94 v40.64,27.94 39.05,27.94 | 39.05,27.94 34.92,27.94 C4.- 35.55,27.92 31.43,27.94 IC4.P$22 v26.67,27.94 | 39.05,27.94 C14.- | ULN2803A.P$9 78.74,12.7
  Bottom 0.406: 78.11,79.38 v78.11,87
  Bottom 0.813: JP17.1 35.56,45.72 43.18,53.34 43.18,55.88 | 40.64,30.48 43.18,33.02 IC1.P$7 | SV1.4 49.53,16.51 48.26,17.78 IC1.P$1 | 88.27,61.59 U$14.GND | 88.27,61.59 91.44,61.59 92.08,62.23 92.08,72.39 | 90.81,72.39 C17.2 92.08,72.39 | U$19.D1A 16.51,81.28 17.04,81.81 C16.- | 16.51,80.01 U$19.D1B | 16.51,78.74 U$19.D2A | 92.08,74.93 92.08,72.39 | 16.51,77.47 U$19.D2B | 53.34,30.48 IC1.P$9 | C22.2 54.93,15.24 51.44,19.05 51.44,26.03 v53.34,27.94 | U$14.VREF2 87,61.59 88.27,61.59 | JP18.1 73.66,39.37 74.93,40.64 74.93,42.55 73.03,44.45 62.23,44.45 | v82.55,8.89 92.71,8.89 96.2,12.38 U$13.EMMITER | 66.67,6.98 C9.2 | 66.67,6.98 61.59,6.98 C11.- | C11.- | 41.27,55.88 C23.2 | 66.67,6.98 D4.A | 92.08,74.93 89.53,74.93 85.09,79.38 83.5,79.38 | 83.5,79.38 C19.- | 80.64,79.38 83.5,79.38 | C8.- 13.03,83.17 12.38,83.82 U$9.EMMITER | JP52.1 v46.99,81.28 49.85,78.42 69.22,78.42 70.17,79.38 78.11,79.38 80.64,79.38 | 80.64,79.38 C18.2 | v93.34,81.28 92.08,80.01 92.08,74.93
  Bottom 1.016: v26.67,27.94 24.13,25.4 | 24.13,25.4 v20.32,25.4 | v31.75,12.06 24.13,19.68 24.13,25.4
  Bottom 1.27: v40.64,27.94 40.64,30.48 | C8.- 13.02,81.28 16.51,81.28
  Bottom 1.422: 35.24,54.61 JP29.1
  Bottom 1.778: 53.34,28.26 v53.34,27.94 | 20.96,55.88 U$25.A | JP25.1 38.73,57.15 | JP29.1 JP28.1 | 34.29,55.88 35.24,54.61
  Bottom 2.184: 53.34,28.26 53.34,30.48 53.34,34.29 62.23,43.18 62.23,44.45 62.23,53.34 57.15,58.42 v55.88,58.42 45.72,58.42 43.18,55.88 41.27,55.88 40.01,55.88 38.73,57.15 | 16.51,81.28 16.51,80.01 16.51,78.74 16.51,77.47 L4990V5.GND 16.51,71.75 13.02,68.26 13.02,57.78 14.6,55.88 20.96,55.88 34.29,55.88 JP24.1 JP25.1 | C16.- 16.83,81.28 16.83,82.87 17.78,83.82 17.67,87.42 14.6,90.49 14.6,93.03 16.51,94.61 28.26,94.61 37.26,85.62 C1.- 38.21,80.12 31.75,73.66 L4990V1.GND
  pour Top (isolate 0.813): 3.81,96.52 3.81,0 100.33,0 100.33,96.52
  pour Bottom (isolate 0.813): 3.81,96.52 3.81,0 100.33,0 100.33,96.52
LED  (via drill 0.81)
  Top 0.813: 21.59,11.43 R9.1 v21.59,13.34 20.64,13.34 20,12.7 IC4.P$13 | v21.59,20.32 22.54,21.27 22.54,48.26 25.4,51.12 25.4,61.91 26.99,63.5 26.99,65.41 25.4,66.67 25.4,70.48 22.23,73.66 D3.C
  Bottom 0.813: v21.59,20.32 v21.59,13.34
MISO
  Top 0.813: SV1.2 44.45,12.7 46.99,15.24 74HCT4053.P$12
MISO/EN0
  Top 0.813: IC4.P$18 33.02,17.78 35.18,19.43 40.58,19.43 41.91,18.1 74HCT4053.P$14
MOSI
  Top 0.813: 74HCT4053.P$2 39.37,10.16 SV1.1
MOSI/PWM
  Top 0.813: IC4.P$17 33.02,15.24 36.2,12.06 38.1,12.06 39.37,13.34 74HCT4053.P$15
N$1
  Top 0.813: R2.2 85.72,53.34 88.9,56.52 88.9,62.23 85.09,66.04 85.09,70.48 78.11,77.47 78.11,84.45 73.66,88.9 66.04,88.9 64.77,90.17 JP55.1
N$2  (via drill 0.81)
  Top 0.813: R33.1 v29.84,77.47 31.43,77.47 D2.C
  Bottom 0.813: U$19.G1 23.81,80.01 23.18,79.38 23.18,78.1 23.81,77.47 U$19.G2 v29.84,77.47
N$3
  Top 0.813: R10.1 74HCT4051.P$3
N$4
  Top 0.813: R6.1 46.36,86.36 43.18,89.53 34.29,89.53 28.57,95.25 13.34,95.25 9.52,91.44 U$9.CATHODE
N$5
  Bottom 0.813: U$22.C 73.17,62.72 73.03,62.86
  Bottom 1.27: 73.03,62.86 70.8,64.77 25.4,64.77 25.08,64.45 U$20.C
  Bottom 1.778: 17.15,59.05 U$4.V+ U$25.C 22.86,59.05 24.77,60.96 U$20.C | 17.15,59.05 U$24.C | 17.15,59.05 U$23.A
N$6
  Top 0.813: R15.2 90.17,2.54 U$13.ANODE
N$7
  Top 0.813: R4.2 58.1,88.58 57.15,87.63 46.99,87.63 43.18,91.44 JP51.1
N$8
  Top 0.813: C21.2 30.16,82.87 IC2.5 26.35,82.87 23.81,80.33 22.23,80.33 D3.A
N$9
  Bottom 0.813: R8.2 92.71,93.98 U$10.ANODE
N$10
  Bottom 0.813: JP3.1 45.72,39.37 48.58,36.51 48.58,28.89 47.62,27.94 IC1.P$5
N$11
  Bottom 0.813: U$14.+IN 89.53,67.94 80.96,67.94 79.69,69.22 36.51,69.22 35.56,68.26 35.56,66.99 | U$14.-IN 89.53,65.41 83.82,65.41 81.6,63.18
  Bottom 1.778: U$6.V+ 29.21,66.99 35.56,66.99 77.79,66.99 81.6,63.18 U$5.V- 84.77,60.01
N$12
  Bottom 1.778: U$4.V- 34.61,62.55 68.26,62.55 71.75,59.05 U$5.V+
N$13
  Top 0.813: 74HCT238.P$15 ULN2803A.P$1
N$14
  Top 0.813: 74HCT238.P$14 ULN2803A.P$2
N$15
  Top 0.813: 74HCT238.P$13 ULN2803A.P$3
N$16
  Top 0.813: 74HCT238.P$12 ULN2803A.P$4
N$17
  Top 0.813: ULN2803A.P$5 74HCT238.P$11
N$18
  Top 0.813: ULN2803A.P$6 74HCT238.P$10
N$19
  Top 0.813: ULN2803A.P$7 74HCT238.P$9
N$20
  Top 0.813: ULN2803A.P$8 74.93,15.24 73.98,16.19 72.71,16.19 68.58,20.32 74HCT238.P$7
N$21
  Top 0.813: LED3.A 21.59,3.81 JP6.1 R9.2
N$22
  Top 0.813: IC4.P$14 14.6,10.16 R26.1
N$23
  Top 0.813: C3.1 31.43,22.86 | 31.43,22.86 31.43,20.95 L1.2 | 31.43,22.86 IC4.P$20
N$24
  Top 0.61: C4.+ 35.56,22.22 33.97,22.22 33.34,22.86 33.34,24.13 32.7,24.76 30.16,24.76 29.53,25.4 IC4.P$21
N$25
  Top 0.813: U$15.8 73.03,6.98 72.39,7.62 JP32.1
N$26
  Top 0.813: U$15.2 69.22,5.71 69.85,6.35 JP36.1
N$27
  Top 0.813: U$16.8 41.91,72.07 JP22.1
N$28
  Top 0.813: U$16.2 39.37,70.8 40.01,71.44 40.01,75.56 JP34.1
N$29
  Top 0.813: LED1.A LED3.K
N$30
  Bottom 0.813: R13.1 U$12.CATHODE
N$32
  Top 0.813: R30.1 29.84,10.16 IC4.P$15
N$33
  Top 0.813: IC4.P$16 25.72,12.7 25.08,13.34 24.13,13.34 R31.1
N$34
  Top 0.813: C7.2 IC4.P$10
N$35
  Top 0.813: C2.2 IC4.P$9
N$36
  Bottom 0.813: IC1.P$13 60.33,20.32 68.58,27.94 68.58,38.1 JP2.1
N$37
  Top 1.778: L4990V5.IN 19.05,75.56 13.97,80.64 13.97,85.38 C16.+
  Bottom 1.778: U$17.C 19.05,71.75 L4990V5.IN
N$38
  Bottom 1.778: U$22.A 89.22,78.71 88.9,79.38 88.9,85.59 U$18.+
N$39
  Bottom 0.813: JP4.1 45.09,41.91 49.85,37.15 49.85,28.26 48.9,27.3 48.9,23.81 47.94,22.86 IC1.P$3
N$40
  Bottom 0.813: JP1.1 68.58,41.91 67.31,40.64 67.31,29.21 63.5,25.4 IC1.P$11
N$42
  Bottom 0.813: U$14.OUT 85.72,71.12 R16.1
N$44
  Top 0.813: IC2.3 20.32,84.14 19.69,83.5 19.69,79.38 20.64,78.42 23.18,78.42 24.13,77.47 R33.2
PWM0A
  Top 0.61: 44.45,68.26 U$16.5 43.81,68.26
  Top 0.813: 44.45,68.26 44.45,65.41 41.27,62.23 31.43,62.23 29.21,60.01 29.21,47.94 25.08,43.81 25.08,17.46 22.86,15.24 IC4.P$12 R23.1
PWM0B
  Top 0.61: 40.01,63.5 40.01,68.9
  Top 0.813: 40.01,63.5 30.8,63.5 27.94,60.64 27.94,48.58 23.81,44.45 23.81,19.37 22.23,17.78 IC4.P$11 R22.1 | 40.01,68.9 41.91,70.8 U$16.7
PWM1A
  Top 0.813: R30.2 29.84,6.35 JP7.1
PWM1B
  Top 0.813: R31.2 JP11.1
PWM2A
  Top 0.813: 36.83,2.22 74HCT4053.P$1 | 36.83,2.22 R25.1 | 36.83,2.22 37.15,1.91 71.12,1.91 72.39,3.17 U$15.5
PWM2B  (via drill 0.81)
  Top 0.61: v19.05,33.02 IC4.P$5 R24.1
  Top 0.813: v19.05,33.02 IC4.P$5 | v71.12,5.08 71.75,5.71 U$15.7
  Bottom 0.813: v71.12,5.08 69.85,3.81 40.64,3.81 35.56,8.89 20.32,8.89 18.41,10.79 18.41,28.57 17.15,29.84 17.15,31.11 v19.05,33.02
RESET  (via drill 0.81)
  Top 0.813: 49.53,15.24 74HCT4053.P$11 74HCT4053.P$10 74HCT4053.P$9 SV1.6 | v19.05,43.18 IC4.P$1 | JP21.1 35.56,36.2 36.83,34.92 49.53,34.92 v51.75,37.15
  Bottom 0.813: v19.05,43.18 28.26,43.18 34.61,36.83 JP21.1 | v51.75,37.15 51.12,36.51 51.12,27.62 50.16,26.67 50.16,17.78 54.61,13.34 SV1.6 R11.1
RX  (via drill 0.81)
  Top 0.813: v19.05,40.64 IC4.P$2
  Bottom 0.813: v19.05,40.64 28.57,40.64 34.29,34.92 36.83,34.92 38.1,36.2 JP12.1
S_ADC
  Top 0.813: R10.2 58.42,59.69 64.07,54.04 64.07,43.12 55.88,34.92 51.75,34.92 50.48,33.66 34.29,33.66 29.84,38.1 IC4.P$26
SCK
  Top 0.813: SV1.3 74HCT4053.P$5
SCK/EN1  (via drill 0.81)
  Top 0.61: v44.45,6.67 74HCT4053.P$4
  Top 0.813: v26.67,20.32 IC4.P$19
  Bottom 0.813: v44.45,6.67 40.32,6.67 39.37,7.62 | 39.37,7.62 39.69,7.3 | 39.37,7.62 v26.67,20.32
SCL
  Top 0.813: JP20.1 45.72,38.73 39.69,45.09 32.39,45.09 31.12,43.81 31.12,43.18 | 31.12,43.18 R28.1 | 31.12,43.18 IC4.P$28
SDA
  Top 0.61: 33.19,41.91 32.7,41.27 29.84,41.27 29.21,40.64
  Top 0.813: 33.19,41.91 R27.1 33.34,43.18 34.14,43.81 38.73,43.81 43.18,39.37 JP9.1 | 29.21,40.64 IC4.P$27
SIN0
  Top 0.813: ULN2803A.P$18 87,33.02 85.72,33.97 R2.1
SIN1
  Top 0.813: R4.1 63.82,88.58 64.77,87.63 73.03,87.63 76.84,83.82 76.84,76.83 83.82,69.85 83.82,64.77 87.63,60.96 87.63,57.15 83.82,53.34 83.82,33.02 86.36,30.48 ULN2803A.P$17
SIN2
  Top 0.813: ULN2803A.P$16 86.36,27.94 82.55,31.75 82.55,57.47 83.19,58.1 83.19,61.28 82.55,61.91 82.55,69.22 75.56,76.2 75.56,83.19 72.39,86.36 R6.2
SIN3
  Top 0.813: ULN2803A.P$15 90.81,25.4 92.08,26.67 92.08,79.38 91.44,80.01 91.44,89.85 93.03,91.44 U$10.CATHODE
SIN4  (via drill 0.81)
  Top 0.813: v86.36,22.86 ULN2803A.P$14
  Bottom 0.813: v86.36,22.86 79.95,16.45 79.95,6.35 75.5,1.91 40.01,1.91 37.47,4.45 17.78,4.45 17.15,5.08 R13.2
SIN5
  Top 0.813: ULN2803A.P$13 91.12,20.32 91.76,19.68 91.76,6.03 92.71,5.08 U$13.CATHODE
SOUT0  (via drill 0.81)
  Top 0.813: 74HCT4051.P$13 v60.96,80.01 60.96,81.91 R1.1
  Bottom 0.813: v60.96,80.01 60.96,83.82 54.61,90.17 JP57.1
SOUT1  (via drill 0.81)
  Top 0.813: 74HCT4051.P$14 58.42,80.01 57.78,80.64 v57.78,84.14 R3.1
  Bottom 0.813: 57.78,84.45 v57.78,84.14 50.48,91.44 JP53.1
SOUT2
  Top 0.813: 74HCT4051.P$15 55.88,82.4 R5.1 55.88,82.7 55.88,84.45 55.24,85.09 45.72,85.09 42.55,88.27 33.66,88.27 27.94,93.98 14.6,93.98 10.8,90.17 10.8,82.55 9.52,81.28 U$9.COLLECTOR
SOUT3  (via drill 0.81)
  Top 0.813: 74HCT4051.P$12 v63.5,80.01
  Bottom 0.813: v63.5,80.01 66.67,80.01 75.25,88.9 88.27,88.9 91.76,85.41 92.39,85.41 R7.1 92.08,85.09 95.88,81.28 U$10.COLLECTOR
SOUT4  (via drill 0.81)
  Top 0.813: 74HCT4051.P$1 53.34,69.85 52.07,71.12 v48.9,71.12 R12.1 | v31.75,69.22 31.75,66.36 26.67,61.28 26.67,49.85 v26.04,49.21
  Bottom 0.813: v31.75,69.22 34.61,69.22 35.88,70.48 48.26,70.48 v48.9,71.12 | v26.04,49.21 20.64,49.21 17.15,46.35 17.15,34.29 13.34,30.48 13.34,17.14 11.43,15.24 U$12.COLLECTOR
SOUT5  (via drill 0.81)
  Top 0.813: 74HCT4051.P$5 63.5,57.15 v66.67,53.97 | v76.2,44.45 80.01,44.45 81.28,43.18 81.28,41.91 | 81.28,41.91 81.28,15.88 v81.91,15.24 | 81.28,41.91 R14.1
  Bottom 0.813: v76.2,44.45 v66.67,53.97 | v81.91,15.24 U$13.COLLECTOR
THR
  Top 0.813: IC2.6 30.48,84.14 30.48,84.77 | 30.48,84.77 R36.1 | JP19.1 27.94,92.07 30.48,89.53 30.48,88.58 | 30.48,88.58 R35.2 | 30.48,84.77 30.48,88.58
TR
  Top 0.813: JP5.1 15.88,90.81 15.88,88.27 18.73,85.41 IC2.2 23.18,85.41 23.81,86.04 23.81,87.95 22.86,88.9 22.86,89.85 | 22.86,89.85 R34.2 | 22.86,89.85 C20.1
TX  (via drill 0.81)
  Top 0.813: v19.05,38.1 IC4.P$3
  Bottom 0.813: v19.05,38.1 29.21,38.1 33.97,33.34 38.1,33.34 40.64,35.88 JP13.1
V+  (via drill 1.02)
  Top 0.813: 34.29,73.03 L4990V1.OUT 34.61,72.07 U$16.1 | U$15.1 66.67,6.98 C11.+ | 35.56,74.61 D1.C
  Top 1.27: U$20.A 34.29,74.61
  Top 1.676: v80.64,59.69 80.64,67.94 v74.93,73.66
  Top 1.778: L4990V1.OUT 34.29,74.61 35.56,74.61 36.51,74.61 38.1,76.2 38.1,79.38 40.75,82.02 C1.+
  Bottom 0.813: D4.C 64.25,10.27 64.14,10.16
  Bottom 1.676: v80.64,59.69 80.64,44.13 70.8,33.97 70.8,23.81 | v74.93,73.66 47.62,73.66 46.36,72.39 L4990V1.OUT
  Bottom 1.778: 70.8,23.81 64.14,17.14 64.14,10.16 64.14,9.52 C11.+
V-BAT  (via drill 1.27)
  Top 0.813: IC2.1 19.69,86.68 18.41,87.95 18.41,89.22 | 18.41,89.22 C20.2 | JP8.1 18.41,90.81 18.41,89.22 | U$6.V- 28.37,80.12 D2.A 31.75,80.01 33.34,80.01 33.34,82.55 | R36.2 33.34,84.77 33.34,82.55 | 33.34,82.55 C21.1
  Route9 1.27: U$6.V- v85.41,81.6
  Bottom 0.813: 21.59,87.95 C15.- | 21.59,87.95 21.59,84.14 21.91,83.82 26.67,83.82 27.94,82.55 27.94,81.28 | 21.59,87.95 20.32,87.95 19.69,88.58 JP8.1 | U$19.S2 26.67,78.74 27.94,80.01 U$6.V- 27.94,81.28 | 27.94,81.28 U$19.S1
  Bottom 1.27: U$18.C 85.09,85.72 82.23,85.72 U$18.-
  Bottom 1.778: v85.41,81.6 85.41,85.72 U$18.C
VCC  (via drill 0.81, 1.02)
  Top 0.61: v36.83,14.6 74HCT4053.P$16 | 38.88,21.91 C14.+ | v65.41,22.86 74HCT238.P$6
  Top 0.813: v53.34,76.2 74HCT4051.P$16 53.34,80.01 52.7,80.64 52.7,82.55 R5.2 49.53,82.55 C13.1 | v83.82,27.94 83.82,14.35 85.47,12.7 ULN2803A.P$10 90.17,12.7 R15.1 | R19.2 71.6,82.55 71.12,82.55 71.12,84.14 | R18.2 68.73,82.55 | R18.2 68.43,82.55 | 66.12,82.63 66.19,82.55 | R17.2 66.12,82.63 | R17.2 65.89,82.55 | L1.1 42.55,20.95 42.55,21.91 | 42.55,21.91 C10.1 | 42.55,21.91 38.88,21.91 | IC4.P$7 C5.1 | v78.11,35.56 78.11,38.1 | 78.11,38.1 C12.1 | 46.36,69.53 U$16.6 42.55,69.53 41.91,68.9 41.91,65.41 C6.1 | v73.66,76.83 73.66,83.19 72.71,84.14 71.12,84.14 | R28.2 31.12,38.73 31.75,38.1 33.34,38.1 | JP16.1 35.56,39.05 33.66,39.05 33.34,38.1 | R27.2 33.49,38.9 33.34,38.1 | 78.11,38.1 78.11,39.37 76.68,40.79 R14.2 JP15.1 | U$15.6 75.56,4.45 v78.11,6.98 | v10.16,9.84 10.16,3.81 8.89,2.54 U$12.ANODE | R12.2 48.9,76.2 v46.36,76.2 | v12.7,87.63 12.06,87 12.06,79.69 13.97,77.79 L4990V5.OUT | R1.2 64.14,81.91 64.14,84.14 | 66.04,82.55 66.04,82.63 66.12,82.63 | 64.14,84.14 R3.2 | 67.31,84.14 v67.31,84.77 | 67.31,84.14 66.04,84.14 R17.2 | 67.31,84.14 64.14,84.14 | 68.58,84.14 67.31,84.14 | 68.58,84.14 R18.2 | 71.12,84.14 68.58,84.14
  Top 1.016: v65.41,22.86 69.85,22.86 71.75,24.76 71.75,34.29 73.03,35.56 74HCT238.P$16 v78.11,35.56 | v46.36,76.2 46.36,69.53 46.36,65.09 40.96,59.69 JP27.1
  Top 1.27: v30.8,46.99 30.8,55.56 34.92,59.69 JP10.1 JP27.1
  Top 1.422: IC4.P$7 v20.32,27.94 20.96,28.57 20.96,46.99 v20.64,46.99 v20.65,46.99
  Top 1.778: L4990V5.OUT 13.34,73.03 13.34,53.67 U$24.A v20.65,46.99
  Bottom 0.61: 78.74,76.2 85.41,76.2
  Bottom 0.813: JP16.1 34.61,39.37 30.8,43.18 v30.8,46.99 | 61.59,12.06 R11.2 | 88.27,72.39 C17.1 | 87,72.39 87,74.61 85.41,76.2 | 87,72.39 U$14.VCC | 61.59,17.78 IC1.P$14 | 61.59,15.24 C22.1 | 87,72.39 88.27,72.39 | 88.27,72.39 U$14.VREF1 | 78.11,27.94 v78.11,6.98 C9.1 | C23.1 41.46,60.64 39.05,60.64 JP27.1 | v46.36,76.2 44.45,78.1 44.45,83.82 36.83,90.81 JP50.1 | v12.7,87.63 12.06,88.58 12.06,93.34 11.43,93.98 U$9.ANODE | v73.66,76.83 73.66,76.2 78.74,76.2 | v67.31,84.77 67.31,90.17 | 67.31,90.17 JP54.1 | 92.08,90.17 R8.1 | 67.31,90.17 92.08,90.17 | 92.08,90.17 R7.2
  Bottom 1.016: v46.36,76.2 v53.34,76.2 73.66,76.2 | v83.82,27.94 78.11,27.94 v78.11,35.56 | v10.16,9.84 15.24,14.6 15.24,26.67 IC4.P$7
  Bottom 1.27: v65.41,22.86 61.59,19.05 61.59,17.78 61.59,15.24 61.59,12.06 61.59,10.79 60.96,10.16 52.07,10.16 | v36.83,14.6 36.83,12.7 39.37,10.16 52.07,10.16 | 52.07,10.16 SV1.5 | C8.+ 13.02,74.61 L4990V5.OUT
  Bottom 1.422: 36.83,20.32 36.83,24.13 30.48,30.48 22.86,30.48 v20.32,27.94 | L1.1 41.91,20.32 36.83,20.32 | 36.83,20.32 v36.83,14.6
  Bottom 1.778: v30.8,46.99 v20.64,46.99
  other vias: 16.51,27.94
VCC/2
  Top 0.813: R20.1 52.07,60.96 53.66,62.23 | R21.2 52.07,63.5 53.66,62.23 | 74HCT4051.P$2 55.88,62.23 53.66,62.23
VDD  (via drill 1.02)
  Top 0.813: R20.2 46.99,60.96 JP30.1 | 25.4,86.68 25.4,85.09 23.18,82.87 IC2.4 | 25.4,86.68 27.3,86.68 | 27.3,86.68 IC2.8 | C24.2 34.8,51.3 JP26.1 | 25.4,89.85 25.4,86.68 | 25.4,89.85 25.4,91.44 JP14.1 | R35.1 27.3,88.43 27.3,86.68 | 25.4,89.85 R34.1
  Top 1.422: v23.5,52.07 23.5,60.96 22.23,62.23 20.64,62.23 17.15,65.72 U$23.C
  Bottom 0.813: L4990V1.IN 29.21,73.98 31.75,76.83 31.75,80.96 24.77,87.95 | 24.77,87.95 JP14.1 | 24.77,87.95 C15.+
  Bottom 1.422: v23.5,52.07 JP26.1 JP30.1
  Bottom 1.778: L4990V1.IN 27.94,72.39 U$17.A 18.41,65.41 U$23.C

### Text on the board
Bottom: Yunimin